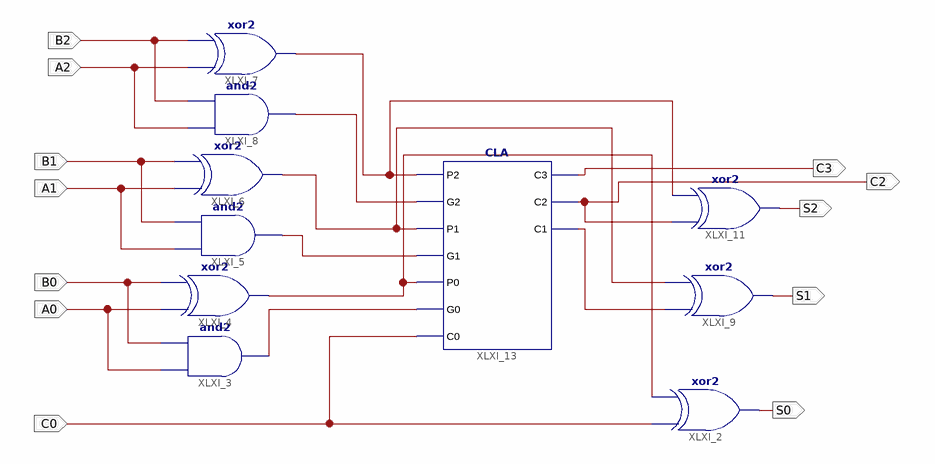
[diagram p0: schematic sheet 1]
// Xilinx ISE schematic Clw2c.sch (spartan3e) as structural Verilog: 10 symbols, 12 ports
module Clw2c (
  input  C0,
  input  B0,
  input  A0,
  input  B1,
  input  A1,
  input  B2,
  input  A2,
  output S0,
  output S1,
  output S2,
  output C2,
  output C3
);

  wire XLXN_3, XLXN_7, XLXN_11, XLXN_12, XLXN_18, XLXN_24, XLXN_25;

  xor XLXI_2 (S0, C0, XLXN_7);
  and XLXI_3 (XLXN_3, A0, B0);
  xor XLXI_4 (XLXN_7, A0, B0);
  and XLXI_5 (XLXN_11, A1, B1);
  xor XLXI_6 (XLXN_12, A1, B1);
  xor XLXI_7 (XLXN_25, A2, B2);
  and XLXI_8 (XLXN_24, A2, B2);
  xor XLXI_9 (S1, XLXN_18, XLXN_12);
  xor XLXI_11 (S2, C2, XLXN_25);
  CLA XLXI_13 (
    .C0(C0), .C1(XLXN_18), .C2(C2), .C3(C3), .G0(XLXN_3), .G1(XLXN_11), .G2(XLXN_24), .P0(XLXN_7),
    .P1(XLXN_12), .P2(XLXN_25));
endmodule
